# EAGLE design PARADAS (EAGLE 6.5.0)
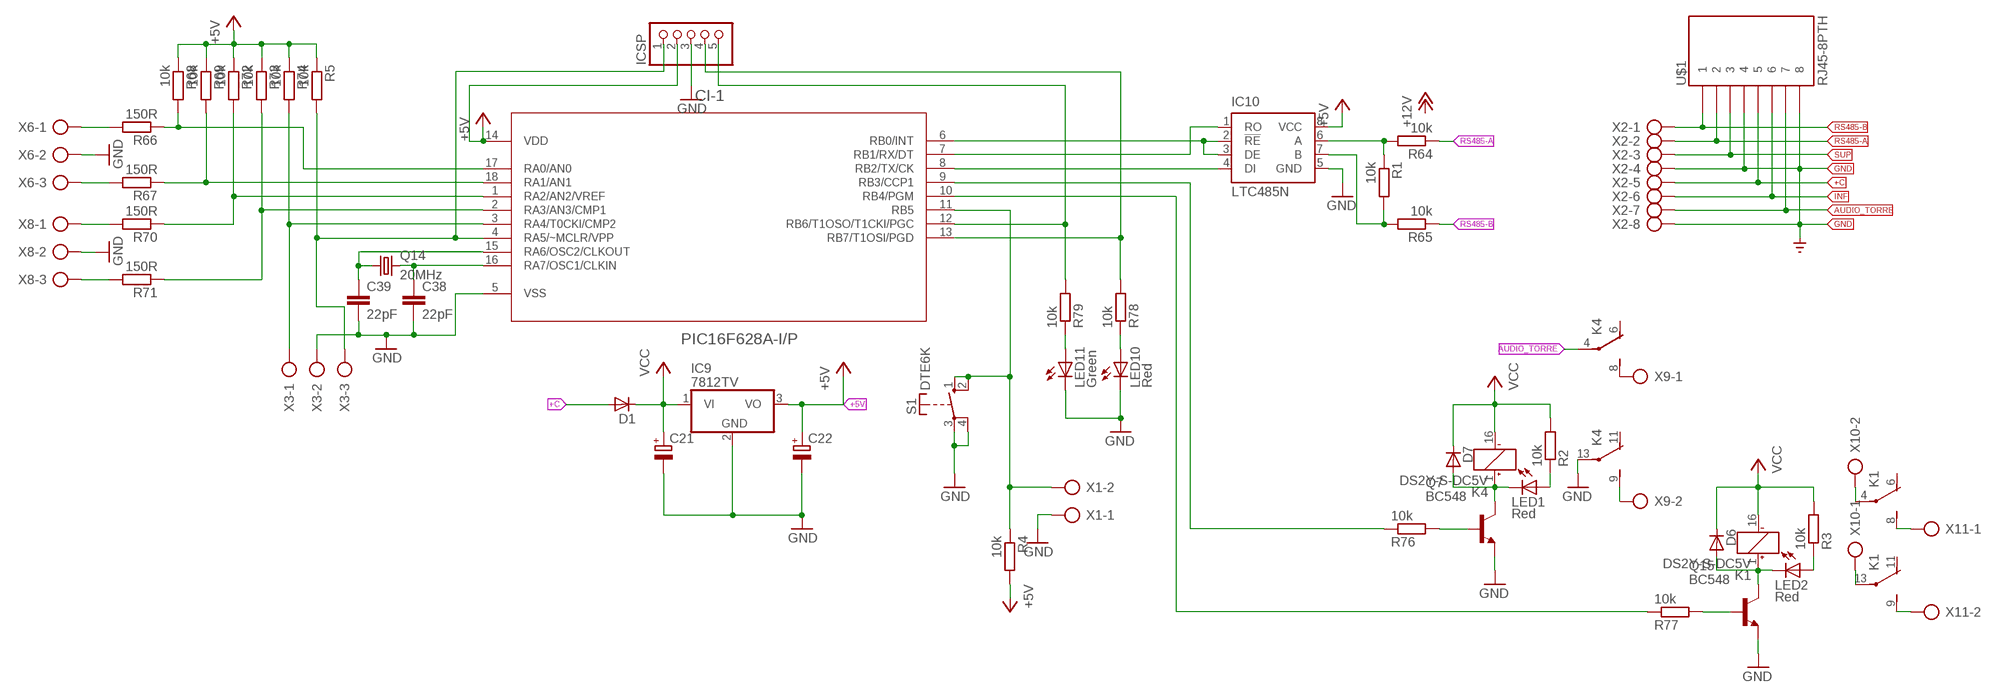
[diagram p0: schematic, sheet 1]

## Parts
C21  CPOL-EUE5-13  [E5-13]
C22  CPOL-EUE5-13  [E5-13]
C38  22pF  C-EUC0805  [C0805]
C39  22pF  C-EUC0805  [C0805]
CI-1  PIC16F628A-I/P  [DIP254P762X533-18]
D1  BYS10  [SOD106A]
D6  BYS10  [SOD106A]
D7  BYS10  [SOD106A]
IC9  7812TV  [TO220V]
IC10  LTC485N  [DIL08]
ICSP  PINHD-1X5  [1X05]
K1  DS2Y-S-DC5V  [DS2Y]
K4  DS2Y-S-DC5V  [DS2Y]
LED1  Red  LED5MM  [LED5MM]
LED2  Red  LED5MM  [LED5MM]
LED10  Red  LED5MM  [LED5MM]
LED11  Green  LED5MM  [LED5MM]
Q7  BC548  [TO92-EBC]
Q14  20MHz  CRYTALHC18U-V  [HC18U-V]
Q15  BC548  [TO92-EBC]
R1  10k  R-EU_0207/10  [0207/10]
R2  10k  R-EU_0207/10  [0207/10]
R3  10k  R-EU_0207/10  [0207/10]
R4  10k  R-EU_0207/10  [0207/10]
R5  10k  R-EU_0207/10  [0207/10]
R64  10k  R-EU_0207/10  [0207/10]
R65  10k  R-EU_0207/10  [0207/10]
R66  150R  R-EU_0207/10  [0207/10]
R67  150R  R-EU_0207/10  [0207/10]
R68  10k  R-EU_0207/10  [0207/10]
R69  10k  R-EU_0207/10  [0207/10]
R70  150R  R-EU_0207/10  [0207/10]
R71  150R  R-EU_0207/10  [0207/10]
R72  10k  R-EU_0207/10  [0207/10]
R73  10k  R-EU_0207/10  [0207/10]
R74  10k  R-EU_0207/10  [0207/10]
R76  10k  R-EU_0207/10  [0207/10]
R77  10k  R-EU_0207/10  [0207/10]
R78  10k  R-EU_0207/10  [0207/10]
R79  10k  R-EU_0207/10  [0207/10]
S1  DTE6K  [DTE6K]
U$1  RJ45-8PTH  [RJ45-8]
X1  AK500/2  [AK500/2]
X2  RS485_CNT  AK500/8  [AK500/8]
X3  AK500/3  [AK500/3]
X6  AK500/3  [AK500/3]
X8  AK500/3  [AK500/3]
X9  AK500/2  [AK500/2]
X10  AK500/2  [AK500/2]
X11  AK500/2  [AK500/2]

## Nets
+5V [power]: C22.+ CI-1.14(VDD) IC9.3(VO) IC10.8(VCC) ICSP.2 R4.2 R5.1 R68.1 R69.1 R72.1 R73.1 R74.1
+C [AC]: D1.A U$1.5 X2.5
AUDIO_TORRE [AC]: K4.4(2:P) U$1.7 X2.7
GND [power]: C21.- C22.- C38.2 C39.2 CI-1.5(VSS) IC9.2(GND) IC10.5(GND) ICSP.3 K4.13(3:P) LED10.K(C) LED11.K(C) Q7.E Q15.E S1.3(P) S1.4(P) U$1.4 U$1.8 X1.1 X2.4 X2.8 X3.2 X6.2 X8.2
INF [power]: U$1.6 X2.6
N$1: LED1.A R2.1
N$2: IC10.7(B) R1.2 R65.2
N$3: IC10.6(A) R1.1 R64.2
N$4: LED2.A R3.1
N$5: CI-1.11(RB5) R4.1 S1.1(S) S1.2(S) X1.2
N$6: CI-1.8(RB2/TX/CK) IC10.4(DI)
N$7 [AC]: K1.4(2:P) X10.2
N$8: CI-1.6(RB0/INT) IC10.2(!RE) IC10.3(DE)
N$9 [AC]: K1.13(3:P) X10.1
N$12: CI-1.4(RA5/~MCLR/VPP) ICSP.1 R5.2 X3.3
N$13: CI-1.13(RB7/T1OSI/PGD) ICSP.4 R78.2
N$14: CI-1.12(RB6/T1OSO/T1CKI/PGC) ICSP.5 R79.2
N$16: CI-1.7(RB1/RX/DT) IC10.1(RO)
N$20: C38.1 CI-1.16(RA7/OSC1/CLKIN) Q14.2
N$22: C39.1 CI-1.15(RA6/OSC2/CLKOUT) Q14.1
N$23: R66.2 X6.1
N$24: CI-1.17(RA0/AN0) R66.1 R68.2
N$26: R67.2 X6.3
N$28: R70.2 X8.1
N$29: CI-1.1(RA2/AN2/VREF) R70.1 R72.2
N$30: CI-1.18(RA1/AN1) R67.1 R69.2
N$32: CI-1.2(RA3/AN3/CMP1) R71.1 R73.2
N$33: R71.2 X8.3
N$36: CI-1.3(RA4/T0CKI/CMP2) R74.2 X3.1
N$37 [AC]: K4.8(2:S) X9.1
N$38 [AC]: K4.9(3:S) X9.2
N$41: D7.A K4.1(1:+) LED1.K(C) Q7.C
N$42: Q7.B R76.2
N$43 [AC]: K1.9(3:S) X11.2
N$45 [AC]: K1.8(2:S) X11.1
N$46: CI-1.9(RB3/CCP1) R76.1
N$47: CI-1.10(RB4/PGM) R77.1
N$48: D6.A K1.1(1:+) LED2.K(C) Q15.C
N$50: Q15.B R77.2
N$54: LED10.A R78.1
N$55: LED11.A R79.1
RS485-A [power]: R64.1 U$1.2 X2.2
RS485-B [power]: R65.1 U$1.1 X2.1
SUP [power]: U$1.3 X2.3
VCC [power]: C21.+ D1.K D6.K D7.K IC9.1(VI) K1.16(1:-) K4.16(1:-) R2.2 R3.2
Unconnected: K1.6(2:O) K1.11(3:O) K4.6(2:O) K4.11(3:O)

## Library data of the parts
C21 C22 = rcl:CPOL-EU: POLARIZED CAPACITOR, European symbol
C38 C39 = rcl:C-EU: CAPACITOR, European symbol
CI-1 = Microchip_By_element14_Batch_1 (2):PIC16F628A-I/P: 8 Bit CMOS Microcontrollers; DESCRIPTION: 8 Bit CMOS Microcontrollers; MPN: PIC16F628A-I/P; OC_FARNELL: 9760423; OC_NEWARK: 92C4532; PACKAGE: DIP-18; SUPPLIER: Microchip
D1 D6 D7 = telefunken:BYS10: DIODE; MPN: BYS10/45; OC_FARNELL: 9549188; OC_NEWARK: 96K7236
IC9 = linear:78*: Positive VOLTAGE REGULATOR Source: http://cache.national.com/ds/LM/LM78L05.pdf http://www.fairchildsemi.com/ds/LM/LM7805.pdf
IC10 = linear-technology:LTC485: Low Power RS485 Interface Transceiver Source: http://www.linear.com/pc/downloadDocument.do?navId=H0,C1,C1007,C1017,P2064,D1718; OC_FARNELL: unknown; OC_NEWARK: unknown
ICSP = pinhead:PINHD-1X5: PIN HEADER
K1 K4 = relay:DS2Y-S-DC*: MINIATURE RELAY NAiS Source: http://www.mew-europe.com/.. en_ds_61005_0023.pdf; MPN: DS2Y-S-DC5V; OC_FARNELL: unknown; OC_NEWARK: 13P3268
LED1 LED2 LED10 LED11 = led:LED: LED OSRAM: - CHIPLED LG R971, LG N971, LY N971, LG Q971, LY Q971, LO R971, LY R971 LH N974, LH R974 LS Q976, LO Q976, LY Q976 LO Q996 - Hyper CHIPLED LW Q18S LB Q993, LB Q99A, LB R99A - SideLED LS A670, LO A670, LY A670, LG A670, LP A670 LB A673, LV A673, LT A673, LW A673 LH A674 LY A675 LS A676, LA A676, LO A676, LY A676, LW A676 LS A679, LY A679, LG A679 - Hyper Micro SIDELED® LS Y876, LA Y876, LO Y876, LY Y876 LT Y87S - SmartLED LW L88C, LW L88S LB L89C, LB L89S, LG L890 LS L89K, LO L89K, LY L89K LS L896, LA L896, LO L896, LY L896 - TOPLED LS T670, LO T670, LY T670, LG T670, LP T670 LSG T670, LSP T670, LSY T670, LOP T670, LYG T670 LG T671, LOG T671, LSG T671 LB T673, LV T673, LT T673, LW T673 LH T674 LS T676, LA T676, LO T676, LY T676, LB T676, LH T676, LSB T676, LW T676 LB T67C, LV T67C, LT T67C, LS T67K, LO T67K, LY T67K, LW E67C LS E67B, LA E67B, LO E67B, LY E67B, LB E67C, LV E67C, LT E67C LW T67C LS T679, LY T679, LG T679 LS T770, LO T770, LY T770, LG T770, LP T770 LB T773, LV T773, LT T773, LW T773 LH T774 LS E675, LA E675, LY E675, LS T675 LS T776, LA T776, LO T776, LY T776, LB T776 LHGB T686 LT T68C, LB T68C - Hyper Mini TOPLED® LB M676 - Mini TOPLED Santana® LG M470 LS M47K, LO M47K, LY M47K Source: http://www.osram.convergy.de LUXEON: - LUMILED® LXK2-PW12-R00, LXK2-PW12-S00, LXK2-PW14-U00, LXK2-PW14-V00 LXK2-PM12-R00, LXK2-PM12-S00, LXK2-PM14-U00 LXK2-PE12-Q00, LXK2-PE12-R00, LXK2-PE12-S00, LXK2-PE14-T00, LXK2-PE14-U00 LXK2-PB12-K00, LXK2-PB12-L00, LXK2-PB12-M00, LXK2-PB14-N00, LXK2-PB14-P00, LXK2-PB14-Q00 LXK2-PR12-L00, LXK2-PR12-M00, LXK2-PR14-Q00, LXK2-PR14-R00 LXK2-PD12-Q00, LXK2-PD12-R00, LXK2-PD12-S00 LXK2-PH12-R00, LXK2-PH12-S00 LXK2-PL12-P00, LXK2-PL12-Q00, LXK2-PL12-R00 Source: www.luxeon.com KINGBRIGHT: KA-3528ASYC Source: www.kingbright.com
Q7 Q15 = transistor-npn:BC548*: NPN Transistor
Q14 = crystal:CRYTAL: CRYSTAL
R1-R5 R64-R74 R76-R79 = rcl:R-EU_: RESISTOR, European symbol
S1 = switch-misc:DT: ITT SWITCH
U$1 = SparkFun-Connectors:RJ45-8: RJ45 Jack Simple RJ45, 8-pin connection - connector for common Cat5, Cat5e, and Cat6 Ethernet cables. Footprint not yet proven in production. Connector sku is PRT-00643; Breakout PCB sku is BOB-00716.
X1 X9-X11 = con-ptr500:AK500/2: CONNECTOR; OC_FARNELL: unknown; OC_NEWARK: unknown
X2 = con-ptr500:AK500/8: CONNECTOR; OC_FARNELL: unknown; OC_NEWARK: unknown
X3 X6 X8 = con-ptr500:AK500/3: CONNECTOR; OC_FARNELL: unknown; OC_NEWARK: unknown

## Net classes
0 default: drill 0.203 mm, clearance 0.203 mm
1 AC: width 1.778 mm, clearance 0.203 mm
2 power: width 0.762 mm, drill 0.203 mm, clearance 0.203 mm

## Board
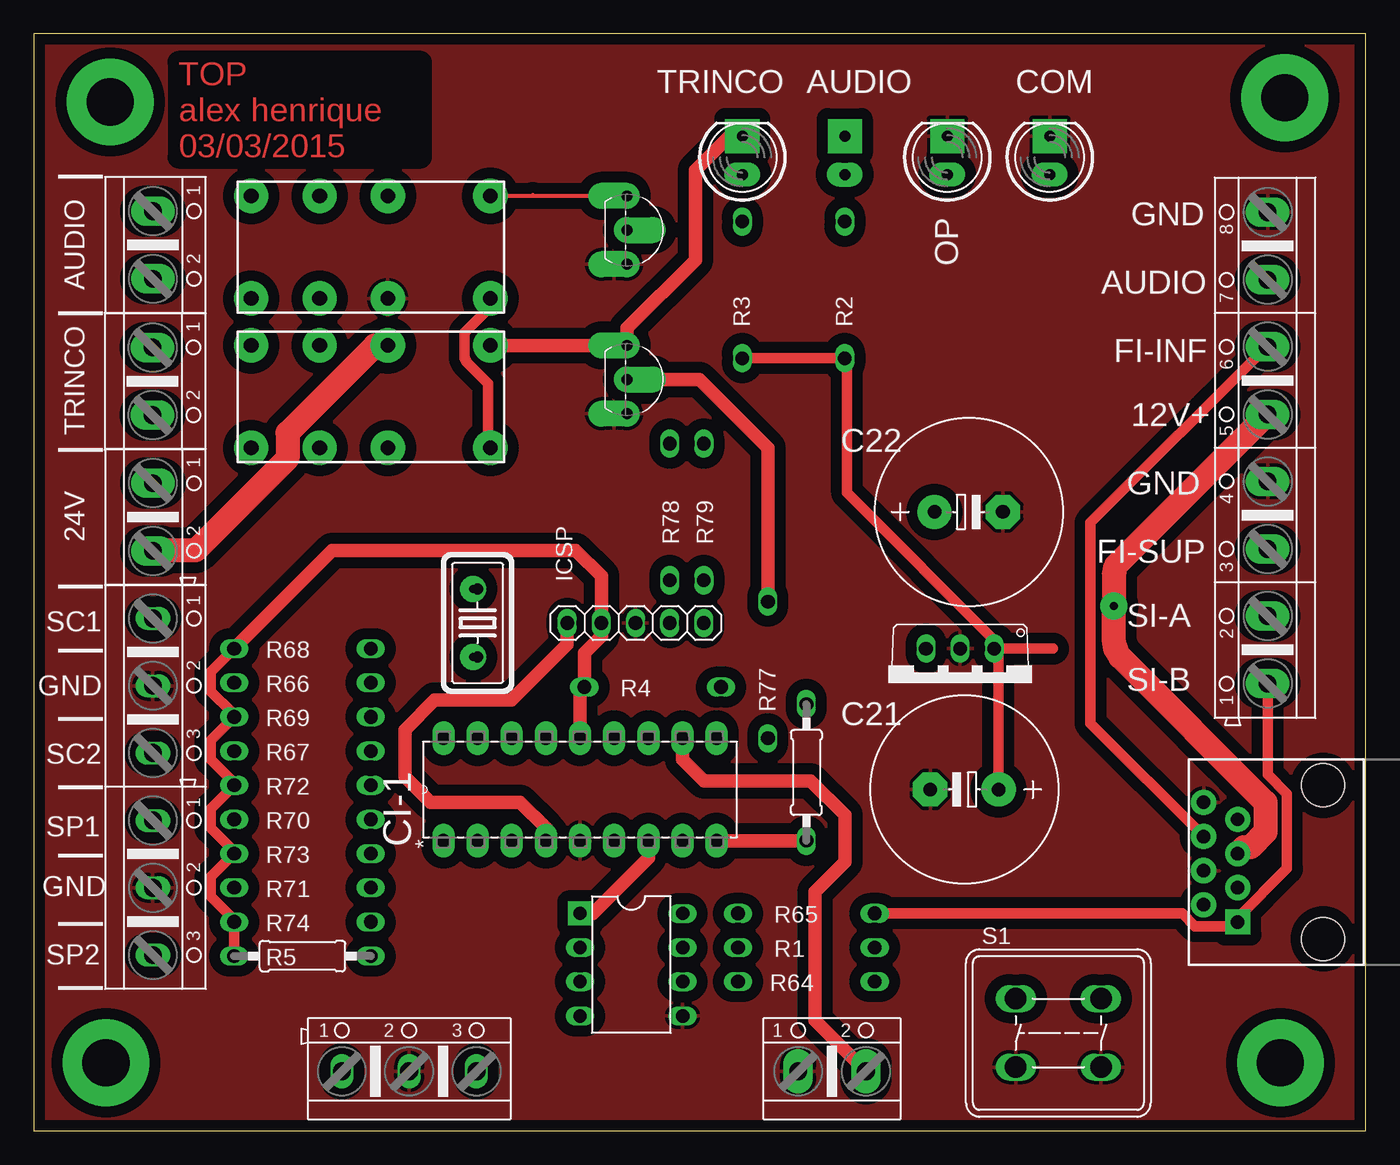
[diagram p1: board, top side]
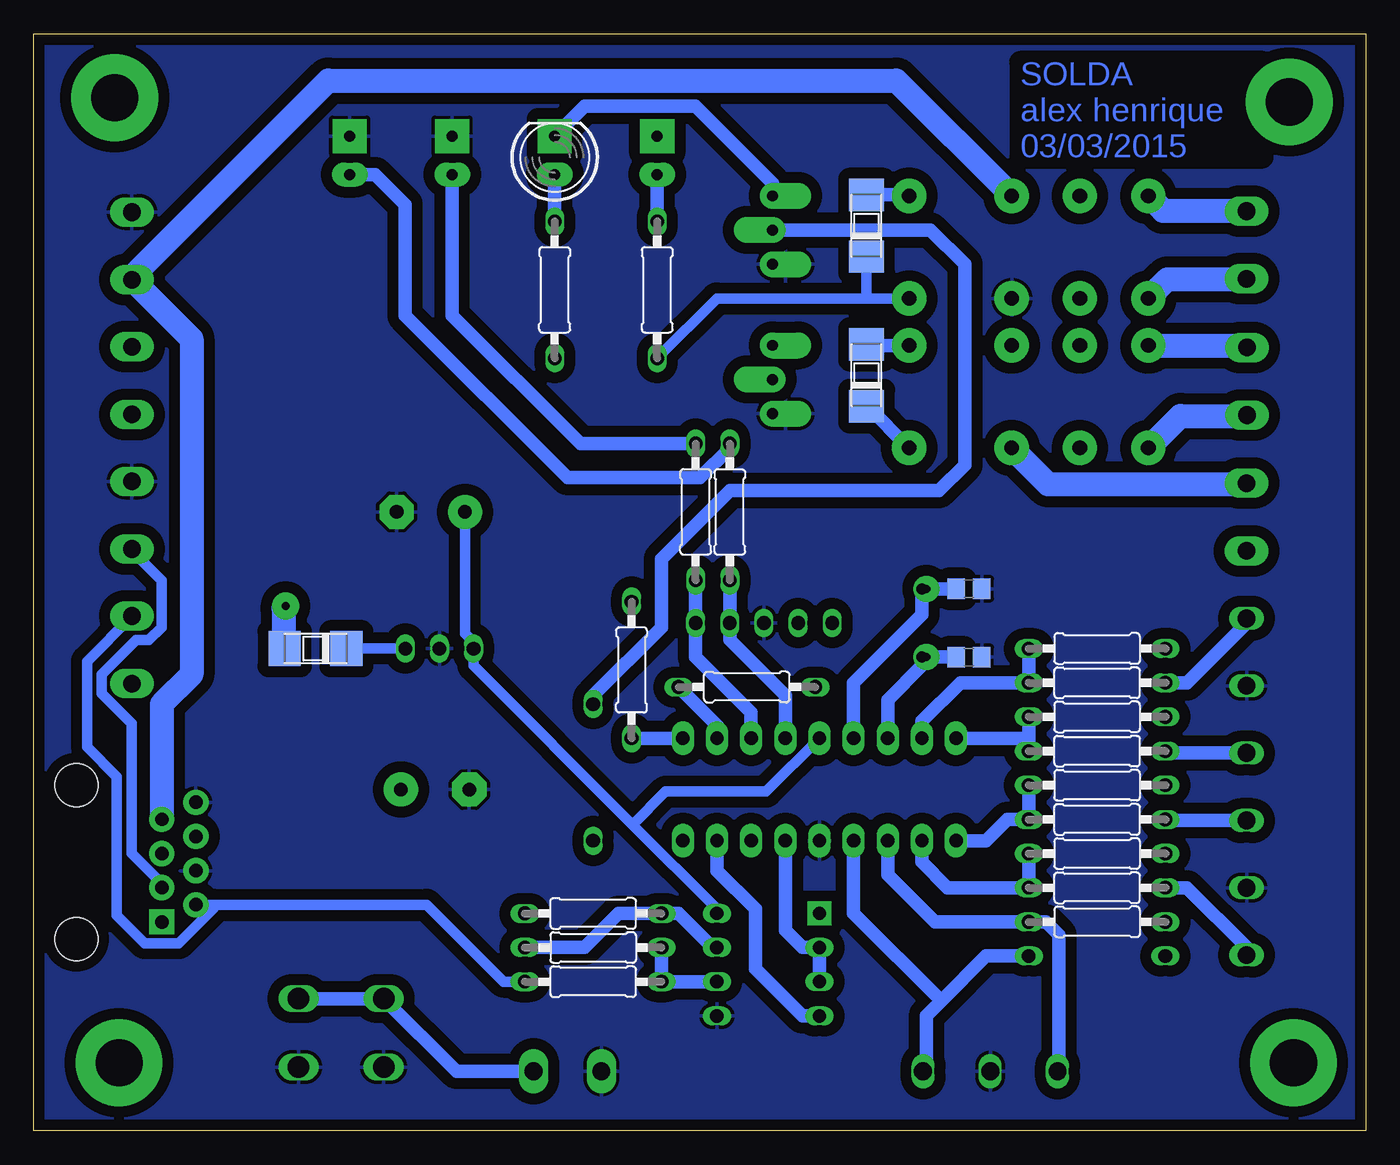
[diagram p2: board, bottom side, seen from below]

Size 99.04 x 81.58 mm. Coordinates in mm from the lower left corner, seen from the top.
Outline: 99.04,81.58 0,81.58 0,0 99.04,0 99.04,81.58
Copper layers (1*16): Top 0.035mm / dielectric 1.5mm / Bottom 0.035mm
Design rules "placa35 *": minimum track width 12mil, minimum drill 20mil, track to track 8mil, track to pad 8mil, pad to pad 8mil, via to via 8mil, smd to smd 8mil, copper to edge 20mil, drill to drill 10mil, minimum pad ring 8mil, minimum via ring 12mil, stop-mask expansion 4mil, vias tented up to drill 0mil, thermal gap 10mil

### Footprints (pad centres in the part's own frame; a part is rotated, then mirrored left to right if it is on the bottom)
E5-13 = drill 1.016 pad 2.54: + -2.54,0 | drill 1.016 pad 2.54 octagon: - 2.54,0
C0805 = smd 1.3 x 1.5: 1 -0.95,0; 2 0.95,0
DIP254P762X533-18 = drill 0.991 pad 1.676 long: 1 -7.62,20.32; 2 -7.62,17.78; 3 -7.62,15.24; 4 -7.62,12.7; 5 -7.62,10.16; 6 -7.62,7.62; 7 -7.62,5.08; 8 -7.62,2.54; 9 -7.62,0; 10 0,0; 11 0,2.54; 12 0,5.08; 13 0,7.62; 14 0,10.16; 15 0,12.7; 16 0,15.24; 17 0,17.78; 18 0,20.32
SOD106A = smd 2.4 x 2.6: A 2.3,0; K -2.3,0
TO220V = drill 1.016 long: 1 -2.54,-2.54; 2 0,-2.54; 3 2.54,-2.54
DIL08 = drill 1 pad 1.778 square: 1 -3.81,-3.81 | drill 1 pad 1.27 long: 2 -1.27,-3.81; 3 1.27,-3.81; 4 3.81,-3.81; 5 3.81,3.81; 6 1.27,3.81; 7 -1.27,3.81; 8 -3.81,3.81
1X05 = drill 1.016 long: 1 -5.08,0; 2 -2.54,0; 3 0,0; 4 2.54,0; 5 5.08,0
DS2Y = drill 1.1 pad 2.54: 1 -8.89,-3.81; 4 -1.27,-3.81; 6 3.81,-3.81; 8 8.89,-3.81; 9 8.89,3.81; 11 3.81,3.81; 13 -1.27,3.81; 16 -8.89,3.81
LED5MM = drill 0.813 pad 1.778 long: A -1.27,0 | drill 0.813 pad 2.54 square: K 1.587,0
TO92-EBC = drill 0.813 pad 1.93 offset: B 0,-1.27; C -2.54,-1.27; E 2.54,-1.27
HC18U-V = drill 0.813: 1 -2.54,0; 2 2.54,0
0207/10 = drill 1.016 pad 1.422 long: 1 -5.08,0; 2 5.08,0
DTE6K = drill 1.6 long: 1 -2.54,2.54; 2 3.81,2.54; 3 3.81,-2.54; 4 -2.54,-2.54
RJ45-8 = drill 1 pad 1.88 square: 1 -4.445,6.35 | drill 1 pad 1.88: 2 -3.175,8.89; 3 -1.905,6.35; 4 -0.635,8.89; 5 0.635,6.35; 6 1.905,8.89; 7 3.175,6.35; 8 4.445,8.89 | hole 3.2: -5.715,0; 5.715,0
AK500/2 = drill 1.321 pad 2.184 long: 1 -2.515,0; 2 2.515,0
AK500/8 = drill 1.321 pad 2.184 long: 1 -17.526,0; 2 -12.497,0; 3 -7.518,0; 4 -2.489,0; 5 2.489,0; 6 7.518,0; 7 12.497,0; 8 17.526,0
AK500/3 = drill 1.321 long: 1 -5.004,0; 2 0,0; 3 5.004,0

### Placement (x,y rotation side)
C21  69.2,25.39 180 top
C22  69.51,46.02 0 top
C38  29.51,35.23 0 bottom
C39  29.51,40.31 0 bottom
CI-1  50.78,29.2 90 top
D1  78.09,35.86 180 bottom
D6  37.13,56.18 90 bottom
D7  37.13,67.3 90 bottom
IC9  68.88,33.32 180 top
IC10  44.43,12.37 270 top
ICSP  44.75,37.77 0 top
K1  25.06,54.6 180 top
K4  25.06,65.71 180 top
LED1  60.3,72.38 90 bottom
LED2  52.68,72.38 90 top
LED10  75.55,72.38 90 top
LED11  67.92,72.38 90 top
Q7  45.38,66.98 270 top
Q14  33,37.77 270 top
Q15  45.38,55.87 270 top
R1  57.45,13.64 180 bottom
R2  60.3,62.53 270 bottom
R3  52.68,62.53 270 bottom
R4  46.02,33.01 0 bottom
R5  19.98,13.01 0 top
R64  57.45,11.1 0 bottom
R65  57.45,16.18 0 bottom
R66  19.98,33.32 0 bottom
R67  19.98,28.25 0 bottom
R68  19.98,35.86 180 bottom
R69  19.98,30.79 180 bottom
R70  19.98,23.16 0 bottom
R71  19.98,18.09 0 bottom
R72  19.98,25.71 180 bottom
R73  19.98,20.62 180 bottom
R74  19.98,15.54 180 bottom
R76  57.45,26.66 90 top
R77  54.59,34.28 90 bottom
R78  47.29,46.02 270 bottom
R79  49.83,46.02 270 bottom
S1  75.55,7.29 0 top
U$1  95.87,19.99 90 top
X1  59.35,4.43 0 top
X2  91.74,50.79 90 top
X3  27.92,4.43 0 top
X6  8.87,33.1 270 top
X8  8.87,18.09 270 top
X9  8.87,65.87 270 top
X10  8.87,45.64 270 top
X11  8.84,55.74 270 top

### Tracks (layer width: path | path; a pad name or v marks a point on that pad's centre or on a via)
+5V
  Top 0.762: R5.1 R74.1 14.74,15.86 13.16,17.45 13.16,18.88 R73.1 14.74,20.94 13.16,22.53 13.16,23.96 R72.1 14.74,26.02 13.16,27.61 13.16,29.04 R69.1 14.74,31.1 13.16,32.69 13.16,34.12 R68.1
  Top 1: R68.1 22.21,43.17 40.3,43.17 42.21,41.26 ICSP.2 42.21,36.82 40.94,35.55 R4.2 40.62,32.69 CI-1.14
  Bottom 0.762: IC10.8 48.24,16.5 54.51,22.77 | 54.51,22.77 66.34,34.6 IC9.3 66.18,36.18 66.97,36.98 C22.+ | CI-1.14 44.59,25.23 52.05,25.23 54.51,22.77
+C  (via drill 0.6 pad 2)
  Top 1.778: 80.47,35.86 D1.A | X2.5 91.74,53.33 80.47,42.06 80.31,41.26 v80.31,39.04 80.31,36.34 D1.A | U$1.5 89.99,21.1 90.47,21.1 91.58,22.21 91.58,24.44 80.78,35.23 D1.A
  Bottom 1.778: v80.31,39.04 80.47,38.88 80.47,35.86 D1.A
AUDIO_TORRE
  Bottom 1.778: U$1.7 89.52,31.74 87.29,33.96 87.29,58.88 91.74,63.33 X2.7 91.26,63.96 77.13,78.09 34.9,78.09 K4.4
GND
  pour Bottom (isolate 0.813): -0.02,81.58 99.04,81.58 99.04,-0.01 -0.02,-0.01
  pour Top (isolate 0.813): -0.02,81.58 99.04,81.58 99.04,-0.01 -0.02,-0.01
INF
  Top 0.762: U$1.6 78.56,30.31 78.56,45.23 91.74,58.41 X2.6
N$1
  Bottom 1: R2.1 LED1.A
N$2
  Bottom 1: IC10.7 48.56,13.64 51.1,16.18 R65.2 55.54,16.18 58.08,13.64 R1.2
N$3
  Bottom 1: IC10.6 R64.2 R1.1
N$4
  Bottom 1: R3.1 LED2.A
N$5  (via drill 0.6)
  Top 1: v61.89,4.43 58.08,8.24 58.08,17.77 60.3,19.99 60.3,23.48 57.76,26.02 49.83,26.02 48.24,27.61 CI-1.11
  Bottom 0.305: v61.89,4.43 X1.2
  Bottom 1: S1.2 S1.1 67.61,4.43 v61.89,4.43 | CI-1.11 48.24,30.15 R4.1
N$6
  Bottom 1: IC10.4 41.89,8.56 45.38,12.05 45.38,16.5 48.24,19.35 CI-1.8
N$7
  Top 1.778: K1.4 25.38,58.41 18.87,51.9 18.87,49.99 12.04,43.17 8.87,43.17 X10.2
N$8
  Bottom 1: CI-1.6 43.16,14.91 41.89,13.64 IC10.2 IC10.3
N$9
  Bottom 1.778: K1.13 23.63,48.09 8.87,48.09 X10.1
N$11  (via drill 3.5 pad 6.45)
  other vias: 92.69,5.07
N$12
  Top 1: ICSP.1 39.67,36.18 35.54,32.06 29.82,32.06 27.6,29.83 27.6,26.34 29.51,24.44 36.17,24.44 38.08,22.53 CI-1.4
  Bottom 0.305: 32.84,5.23 32.84,4.43 X3.3
  Bottom 1: R5.2 28.24,13.01 31.57,9.67 | 31.57,9.67 32.68,8.56 32.68,4.67 X3.3 | CI-1.4 38.08,16.18 31.57,9.67
N$13
  Bottom 1: CI-1.13 43.16,32.37 47.29,36.5 ICSP.4 R78.2
N$14
  Bottom 1: CI-1.12 45.7,31.1 49.83,35.23 ICSP.5 R79.2
N$15  (via drill 3.5 pad 6.45)
  other vias: 93.01,76.82
N$16
  Top 1: IC10.1 41.57,16.18 45.7,20.31 CI-1.7
N$17  (via drill 3.5 pad 6.45)
  other vias: 5.7,76.5
N$18  (via drill 3.5 pad 6.45)
  other vias: 5.38,5.07
N$20  (via drill 0.6 pad 1.93)
  Bottom 1: CI-1.16 35.54,32.06 33,34.6 Q14.2 v32.68,35.23 C38.1
N$22  (via drill 0.6 pad 1.93)
  Bottom 1: CI-1.15 38.08,33.32 33,38.4 Q14.1 v32.68,40.31 C39.1
N$23
  Bottom 0.305: 8.87,38.25 X6.1
  Bottom 1: X6.1 | X6.1 8.87,37.77 13.32,33.32 R66.2
N$24
  Bottom 1: CI-1.17 33,30.47 30.14,33.32 R66.1 R68.2
N$26
  Bottom 0.305: X6.3 | 8.87,28.25 X6.3
  Bottom 1: X6.3 14.76,28.1 R67.2
N$28
  Bottom 1: X8.1 14.83,23.09 R70.2
N$29
  Bottom 1: R72.2 R70.1 26.65,23.16 28.24,21.58 CI-1.1
N$30
  Bottom 1: R69.2 25.06,29.51 | 25.06,29.51 R67.1 | CI-1.18 25.38,29.2 25.06,29.51
N$32
  Bottom 1: R73.2 R71.1 31.09,18.09 33,19.99 CI-1.2
N$33
  Bottom 1: X8.3 8.87,13.64 13.32,18.09 R71.2
N$36
  Bottom 0.305: 23,4.43 X3.1
  Bottom 1: X3.1 22.84,4.51 22.84,14.59 23.79,15.54 R74.2 32.05,15.54 35.54,19.04 CI-1.3
N$37
  Bottom 1.778: K4.8 15.06,68.41 8.87,68.41 X9.1
N$38
  Bottom 1.778: 8.87,63.33 14.74,63.33 K4.9 | 8.87,63.33 X9.2 | 8.87,63.33
N$41
  Top 0.305: K4.1 37.13,69.52 | 37.13,69.52 Q7.C | 37.13,69.52 D7.A
  Bottom 1: Q7.C 44.11,70.47 49.83,76.19 58.08,76.19 LED1.K | D7.A 34.03,69.6 K4.1
N$42
  Bottom 1: R76.2 57.45,32.37 52.37,37.45 52.37,42.53 47.29,47.61 31.73,47.61 29.82,49.52 29.82,64.44 32.36,66.98 Q7.B
N$43
  Bottom 1.778: K1.9 13.79,53.17 8.87,53.17 X11.2 | X11.2 8.87,53.33 X11.2
N$45
  Bottom 1.778: K1.8 8.87,58.41 X11.1 | X11.1 | X11.1 8.87,58.25 X11.1
N$46
  Top 1: CI-1.9 R76.1
N$47
  Bottom 1: CI-1.10 R77.1
N$48
  Top 0.305: 37.13,58.57 37.13,58.41
  Top 1: K1.1 37.13,58.41 Q15.C 44.11,59.68 49.19,64.76 49.19,71.43 51.73,73.97 LED2.K
  Bottom 1: D6.A 36.57,58.49 36.49,58.41 K1.1
N$50
  Top 1: Q15.B 49.51,55.87 54.59,50.79 R77.2
N$54
  Bottom 1: R78.1 47.29,50.79 49.51,48.57 59.35,48.57 71.42,60.63 71.42,68.88 73.64,71.11 LED10.A
N$55
  Bottom 1: R79.1 58.4,51.1 67.92,60.63 LED11.A
RS485-A
  Bottom 0.762: U$1.2 85.7,16.82 | 85.7,16.82 69.83,16.82 64.12,11.1 R64.1 | X2.2 91.74,38.25 95.07,34.91 95.07,28.56 92.85,26.34 92.85,16.02 90.79,13.96 88.25,13.96 85.7,16.5 85.7,16.82
RS485-B
  Top 0.762: R65.1 85.39,16.18 86.34,15.23 89.2,15.23 U$1.1 89.52,15.86 93.17,19.51 93.17,25.07 91.74,26.5 X2.1
SUP
  Bottom 0.762: U$1.3 89.52,18.4 91.74,20.62 91.74,30.31 93.96,32.53 93.96,33.96 91.42,36.5 90.47,36.5 89.52,37.45 89.52,40.95 91.74,43.17 X2.3
VCC
  Top 0.762: 34.11,50.79 K1.16 33.79,51.1 33.79,55.55 32.21,57.14 32.05,57.46 32.05,59.36 34.27,61.58 K4.16 34.11,61.9 | R3.2 R2.2 60.46,57.14 60.46,47.45 71.73,36.18 IC9.1 | IC9.1 D1.K | C21.+ 71.73,35.55 IC9.1
  Bottom 0.762: 37.13,61.9 48.24,61.9 R3.2 | 37.13,61.9 K4.16 | IC9.1 D1.K | 37.13,61.9 D7.K
  Bottom 1: D6.K 37.05,53.89 K1.16

### Text on the board
Top: TOP / alex henrique / 03/03/2015
Bottom: SOLDA / alex henrique / 03/03/2015
tPlace: | | AUDIO | | | TRINCO | | | 24V | | | SC1 | | | GND | | | SC2 | | | SP1 | | | GND | |
tNames: TRINCO | AUDIO | COM | OP | GND | AUDIO | FI-INF | 12V+ | GND | FI-SUP | SI-A | SI-B | SP2 | |